# Altium schematic sheet Sensors.SchDoc
size A; SheetNumber: 2; SheetTotal: 9
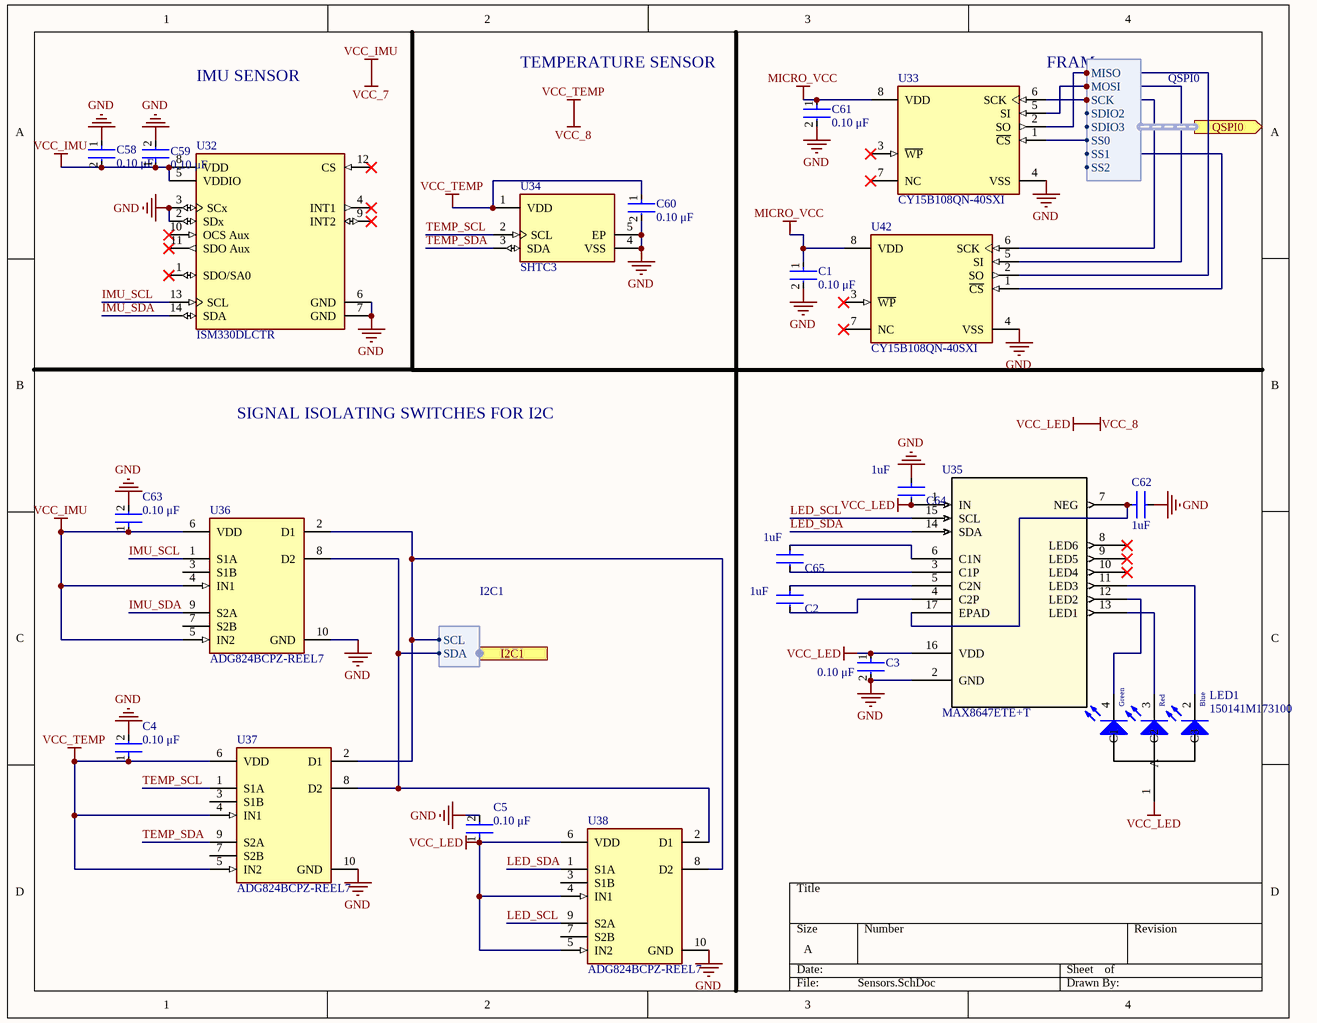
[diagram p0: Sensors.SchDoc]

## Parts
C1  Capacitance: 0.10 μF  [FP-C0402-BB-MFG]  (hidden comment: C0402C104K8PACTU)
C2  Capacitance: 1uF  [FP-GRM15-0_1-MFG]  (hidden comment: GRT155R61C105KE01J)
C3  Capacitance: 0.10 μF  [FP-C0402-BB-MFG]  (hidden comment: C0402C104K8PACTU)
C4  Capacitance: 0.10 μF  [FP-C0402-BB-MFG]  (hidden comment: C0402C104K8PACTU)
C5  Capacitance: 0.10 μF  [FP-C0402-BB-MFG]  (hidden comment: C0402C104K8PACTU)
C58  Capacitance: 0.10 μF  [FP-C0402-BB-MFG]  (hidden comment: C0402C104K8PACTU)
C59  Capacitance: 0.10 μF  [FP-C0402-BB-MFG]  (hidden comment: C0402C104K8PACTU)
C60  Capacitance: 0.10 μF  [FP-C0402-BB-MFG]  (hidden comment: C0402C104K8PACTU)
C61  Capacitance: 0.10 μF  [FP-C0402-BB-MFG]  (hidden comment: C0402C104K8PACTU)
C62  Capacitance: 1uF  [FP-GRM15-0_1-MFG]  (hidden comment: GRT155R61C105KE01J)
C63  Capacitance: 0.10 μF  [FP-C0402-BB-MFG]  (hidden comment: C0402C104K8PACTU)
C64  Capacitance: 1uF  [FP-GRM15-0_1-MFG]  (hidden comment: GRT155R61C105KE01J)
C65  Capacitance: 1uF  [FP-GRM15-0_1-MFG]  (hidden comment: GRT155R61C105KE01J)
LED1  150141M173100  [3528_A]
U32  ISM330DLCTR  [FP-LGA-14L-DM00249496-MFG]
U33  CY15B108QN-40SXI  [FP-001-85261-IPC_C]
U34  SHTC3  [FP-SHTC3-MFG]
U35  MAX8647ETE+T  [21-0136_T1633+5_MXM-L]
U36  ADG824BCPZ-REEL7  [FP-CP-10-10-MFG]
U37  ADG824BCPZ-REEL7  [FP-CP-10-10-MFG]
U38  ADG824BCPZ-REEL7  [FP-CP-10-10-MFG]
U42  CY15B108QN-40SXI  [FP-001-85261-IPC_C]

## Ports
I2C1 (out, harness I2C1), QSPI0 (out, harness QSPI0)

## Harnesses
I2C1: SCL, SDA
QSPI0: MISO, MOSI, SCK, SDIO2, SDIO3, SS0, SS1, SS2

## Nets
GND: C1.2 C3.2 C4.2 C5.2 C58.1 C59.2 C60.2 C61.2 C62.2 C63.2 C64.1 U32.2(SDx) U32.3(SCx) U32.6(GND) U32.7(GND) U33.4(VSS) U34.4(VSS) U34.5(EP) U35.2(GND) U36.10(GND) U37.10(GND) U38.10(GND) U42.4(VSS)
MICRO_VCC: C1.1 C61.1 U33.8(VDD) U42.8(VDD)
VCC_7: C58.2 C59.1 C63.1 U32.5(VDDIO) U32.8(VDD) U36.4(IN1) U36.5(IN2) U36.6(VDD)  [also labelled VCC_IMU]
VCC_8: C3.1 C4.1 C5.1 C60.1 C64.2 LED1.1(A) U34.1(VDD) U35.1(IN) U35.16(VDD) U37.4(IN1) U37.5(IN2) U37.6(VDD) U38.4(IN1) U38.5(IN2) U38.6(VDD)  [also labelled VCC_LED, VCC_TEMP]
IMU_SCL: U32.13(SCL) U36.1(S1A)
IMU_SDA: U32.14(SDA) U36.9(S2A)
LED_SCL: U35.15(SCL) U38.9(S2A)
LED_SDA: U35.14(SDA) U38.1(S1A)
TEMP_SCL: U34.2(SCL) U37.1(S1A)
TEMP_SDA: U34.3(SDA) U37.9(S2A)
NetC2_1: C2.1 U35.5(C2N)
NetC2_2: C2.2 U35.4(C2P)
NetC62_1: C62.1 U35.7(NEG) U35.17(EPAD)
NetC65_1: C65.1 U35.6(C1N)
NetC65_2: C65.2 U35.3(C1P)
NetLED1_2: LED1.2(C3) U35.11(LED3)
NetLED1_3: LED1.3(C2) U35.13(LED1)
NetLED1_4: LED1.4(C1) U35.12(LED2)
NetU33_1: U33.1(~{CS}) ; port QSPI0.SS0
NetU33_2: U33.2(SO) U42.2(SO) ; port QSPI0.MISO
NetU33_5: U33.5(SI) U42.5(SI) ; port QSPI0.MOSI
NetU33_6: U33.6(SCK) U42.6(SCK) ; port QSPI0.SCK
NetU36_2: U36.2(D1) U37.2(D1) U38.8(D2) ; port I2C1.SCL
NetU36_8: U36.8(D2) U37.8(D2) U38.2(D1) ; port I2C1.SDA
NetU42_1: U42.1(~{CS}) ; port QSPI0.SS1

Not connected (* = marked no-connect by the designer): U32 1(SDO/SA0)* 4(INT1)* 9(INT2)* 10(OCS_Aux)* 11(SDO_Aux)* 12(CS)*; U33 3(~{WP})* 7(NC)*; U35 8(LED6)* 9(LED5)* 10(LED4)*; U36 3(S1B) 7(S2B); U37 3(S1B) 7(S2B); U38 3(S1B) 7(S2B); U42 3(~{WP})* 7(NC)*

## Notes on the sheet
- IMU SENSOR
- TEMPERATURE SENSOR
- (near U33) FRAM
- SIGNAL ISOLATING SWITCHES FOR I2C
- (in symbol CMP-1431-00001-1) Green; Red; Blue

## Library data of the parts
C1 C3-C5 C58-C61 C63 = CMP-2008-02046-2: CAP CER 0.1UF 10V X5R 0402; Manufacturer: Kemet; Material: Ceramic; Temperature Coefficient: 15%; Tolerance: 0.1; Value: 0.10 μF; Package: C0402-BB; Temperature: -55°C to +125°C; ComponentLink2Description: Datasheet; Temperature Characteristic: X5R; Device Class L1: Passive Components; Height: 0.55mm; Lead Free: Yes; ComponentLink2URL: https://content.kemet.com/datasheets/KEM_C1002_X7R_SMD.pdf; Device Class L2: Capacitors; Temperature Range Low: -55°C; Temperature Range High: +125°C; RoHS: TRUE; Octopart: https://octopart.com/c0402c104k8pactu-kemet-140039; Automotive: No; Mouser Description: Capacitor 100 nF 10 VDC 0402; Category: Cap; Voltage Rating: 10 V; Digikey Description: CAP CER 0.1UF 10V X5R 0402; Ipc Land Pattern Name: CAPC10050X50; Device Class L3: Ceramic Capacitors; Manufacturer Part Number: C0402C104K8PACTU
C2 C62 C64 C65 = CMP-2008-04556-2: CAP CER 1UF 10V X5R 0402; Manufacturer Part Number: GRM155R61A105KE15D; Manufacturer: Murata; Material: Ceramic; Tolerance: 10%; Temperature Coefficient: 15%; Octopart: https://octopart.com/grm155r61a105ke15d-murata-197442; Lead Free: Yes; ComponentLink2Description: Datasheet; Temperature: -55°C to +85°C; Temperature Range High: +85°C; Height: 0.55mm; Ipc Land Pattern Name: CAPC10050X50; ComponentLink2URL: https://search.murata.co.jp/Ceramy/image/img/A01X/G101/ENG/GRM155R61A105KE15-01A.pdf; Temperature Range Low: -55°C; Device Class L2: Capacitors; Voltage Rating: 10V; RoHS: TRUE; Device Class L1: Passive Components; Device Class L3: Ceramic Capacitors; Temperature Characteristic: X5R; Mouser Description: 0402 1 uF 10 V ±10% Tolerance X5R Surface Mount Multilayer Ceramic Capacitor; Automotive: No; Package: GRM15-0.1; Digikey Description: CAP CER 1UF 10V X5R 0402; Value: 1uF; Category: Cap
LED1 = CMP-1431-00001-1: SMD Full-Color Top LED, WL-SFTW, Red & Green & Blue; Manufacturer: Wuerth Elektronik; PackageReference: 3528_A; PartNumber: 150141M173100; ComponentLink2Description: Datasheet; ComponentLink1URL: http://www.we-online.com; Color: Red & Green & Blue; ComponentLink1Description: Manufacturer URL; ComponentLink2URL: http://katalog.we-online.com/led/datasheet/150141M173100.pdf
U32 = CMP-12177-000013-1: INEMO INERTIAL MODULE; Manufacturer: STMicroelectronics; Accel Range: 2/4/8/16g; Min Supply Voltage: 1.62V; Sensor Type: Temperature,Accelerometer,Gyroscope; Gyro Range: 125/250/500/1000/2000°/s; Sensor Output: I2C,SPI; Max Supply Voltage: 3.6V; Operating Supply Current: 0.35-0.75mA; Manufacturer Part Number: ISM330DLCTR; Category: IC; Height: 0.86mm; Octopart: https://octopart.com/ism330dlctr-stmicroelectronics-85149243; Device Class L2: Motion Sensors; Temperature Range Low: -40°C; Device Class L1: Sensors; Digikey Description: INEMO INERTIAL MODULE; Lead Free: Yes; Device Class L3: Inertial Measurement Units (IMUs); ComponentLink2URL: https://www.st.com/resource/en/datasheet/ism330dlc.pdf; Package: LGA-14L-DM00249496; RoHS: TRUE; Automotive: No; Footprint Url: https://www.st.com/content/ccc/resource/technical/document/technical_note/73/17/9c/16/dd/96/4a/01/CD00134799.pdf/files/CD00134799.pdf/jcr:content/translations/en.CD00134799.pdf; Temperature Range High: +85°C; Temperature: -40°C to +85°C; ComponentLink2Description: Datasheet
U33 U42 = CMP-12945-000022-1: IC FRAM 8MBIT 40MHZ 8EIAJ; RoHS Compliant: Yes
U34 = CMP-144040-000003-1: SENSOR HUMI/TEMP I2C 2% SMD; Manufacturer: Sensirion; Operating Supply Current: 0.3-900uA; Resolution: 16bits; Min Supply Voltage: 1.62V; Max Supply Voltage: 3.6V; Category: IC; Device Class L3: unset; ComponentLink2URL: https://www.sensirion.com/fileadmin/user_upload/customers/sensirion/Dokumente/0_Datasheets/Humidity/Sensirion_Humidity_Sensors_SHTC3_Datasheet.pdf; Ipc Land Pattern Name: DFN200X200X75-4; RoHS: TRUE; Height: 0.75mm; Interface: I2C; Temperature Range High: +125°C; Accuracy: 2%; Sensor Output: I2C; Automotive: No; Package: 0; Device Class L1: Sensors; Manufacturer Part Number: SHTC3; Digikey Description: SENSOR HUMI/TEMP I2C 2% SMD; Lead Free: Yes; Temperature: -40°C to +125°C; Device Class L2: Temperature and Humidity Sensors; ComponentLink2Description: Datasheet; Octopart: https://octopart.com/shtc3-sensirion-91912225; Mouser Description: SHTC3 Series 0 to 100% RH 3.6 V Humidity and Temperature Sensor IC - DFN-4; Temperature Range Low: -40°C
U35 = MAX8647ETE+T: No Description Available; SourceLibrary: Update_to_database_2021-01-29; Built_By: EMA_UL_Team; Vendor: Maxim Integrated Products; Revision: 4; Manufacturer_Part_Number: MAX8647ETE+T; Copyright: Copyright (C) 2021 Accelerated Designs. All rights reserved; RefDes: RefDes; Type: DEV
U36-U38 = CMP-09113-000012-1: IC SWITCH DUAL SPDT 10LFCSP; Manufacturer: Analog Devices; Nominal Supply Current: 0.003uA; Max Supply Voltage: 3.6V; Interface: LVCMOS; On State Resistance: 0.5Ω; -3Db Bandwith: 90MHz; Number Of Circuits: 2; Mux Demux Ratio: 1:2; Standoff Height: 0.02mm; Min Supply Voltage: 1.65V; Temperature: -40°C to +85°C; ComponentLink2URL: https://www.analog.com/media/en/technical-documentation/data-sheets/ADG824.pdf; Device Class L2: Interface ICs; Octopart: https://octopart.com/adg824bcpz-reel7-analog+devices-12410880; Temperature Range High: +85°C; Manufacturer Part Number: ADG824BCPZ-REEL7; Lead Free: Yes; Temperature Range Low: -40°C; ComponentLink2Description: Datasheet; Footprint Url: https://www.analog.com/media/en/symbols-footprints/symbols/ADG824BCPZ-REEL7.bxl; RoHS: TRUE; Device Class L3: Analog Switches; Device Class L1: Integrated Circuits (ICs); Automotive: No; Height: 0.6mm; Package: CP-10-10; Throw Configuration: SPDT; Category: IC; Digikey Description: IC SWITCH DUAL SPDT 10LFCSP